# EAGLE design ESP8266_BREAKOUT (EAGLE 7.2.0)
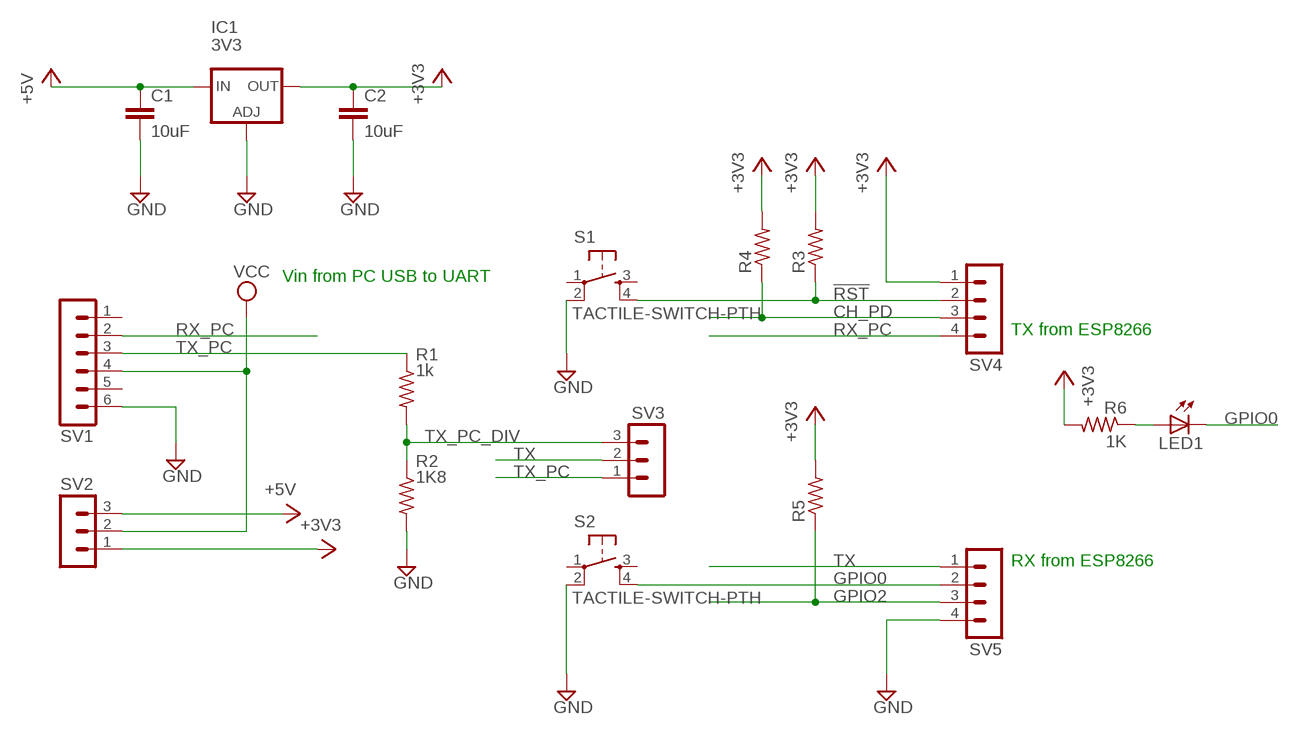
[diagram p0: schematic, sheet 1]

## Parts
C1  10uF  C5/2.5  [C5B2.5]
C2  10uF  C5/2.5  [C5B2.5]
IC1  3V3  LM317TS  [317TS]
LED1  LED5MM  [LED5MM]
R1  1k  R-US_0204/7  [0204/7]
R2  1K8  R-US_0204/7  [0204/7]
R3  R-US_0204/7  [0204/7]
R4  R-US_0204/7  [0204/7]
R5  R-US_0204/7  [0204/7]
R6  1K  R-US_0204/7  [0204/7]
S1  TACTILE-SWITCH-PTH  [TAC-SWITCH-PTH]
S2  TACTILE-SWITCH-PTH  [TAC-SWITCH-PTH]
SV1  MA06-1  [MA06-1]
SV2  MA03-1  [MA03-1]
SV3  MA03-1  [MA03-1]
SV4  MA04-1  [MA04-1]
SV5  MA04-1  [MA04-1]

## Nets
!RST: R3.1 S1.4 SV4.2
+3V3: C2.1 IC1.2(OUT) R3.2 R4.2 R5.2 R6.2 SV2.1 SV4.1
+5V: C1.1 IC1.3(IN) SV2.3
CH_PD: R4.1 SV4.3
GND: C1.2 C2.2 IC1.1(ADJ) R2.2 S1.2 S2.2 SV1.6 SV5.4
GPIO0: LED1.K(C) S2.4 SV5.2
GPIO2: R5.1 SV5.3
N$1: LED1.A R6.1
RX_PC: SV1.2 SV4.4
TX: SV3.2 SV5.1
TX_PC: R1.1 SV1.3 SV3.1
TX_PC_DIV: R1.2 R2.1 SV3.3
VCC: SV1.4 SV2.2
Unconnected: S1.1 S1.3 S2.1 S2.3 SV1.1 SV1.5

## Notes on the sheet
- Vin from PC USB to UART
- TX from ESP8266
- RX from ESP8266

## Library data of the parts
C1 C2 = capacitor-wima:C: CAPACITOR naming: grid - package width
IC1 = v-reg:LM317TS: VOLTAGE REGULATOR
LED1 = led:LED: LED OSRAM: - CHIPLED LG R971, LG N971, LY N971, LG Q971, LY Q971, LO R971, LY R971 LH N974, LH R974 LS Q976, LO Q976, LY Q976 LO Q996 - Hyper CHIPLED LW Q18S LB Q993, LB Q99A, LB R99A - SideLED LS A670, LO A670, LY A670, LG A670, LP A670 LB A673, LV A673, LT A673, LW A673 LH A674 LY A675 LS A676, LA A676, LO A676, LY A676, LW A676 LS A679, LY A679, LG A679 - Hyper Micro SIDELED® LS Y876, LA Y876, LO Y876, LY Y876 LT Y87S - SmartLED LW L88C, LW L88S LB L89C, LB L89S, LG L890 LS L89K, LO L89K, LY L89K LS L896, LA L896, LO L896, LY L896 - TOPLED LS T670, LO T670, LY T670, LG T670, LP T670 LSG T670, LSP T670, LSY T670, LOP T670, LYG T670 LG T671, LOG T671, LSG T671 LB T673, LV T673, LT T673, LW T673 LH T674 LS T676, LA T676, LO T676, LY T676, LB T676, LH T676, LSB T676, LW T676 LB T67C, LV T67C, LT T67C, LS T67K, LO T67K, LY T67K, LW E67C LS E67B, LA E67B, LO E67B, LY E67B, LB E67C, LV E67C, LT E67C LW T67C LS T679, LY T679, LG T679 LS T770, LO T770, LY T770, LG T770, LP T770 LB T773, LV T773, LT T773, LW T773 LH T774 LS E675, LA E675, LY E675, LS T675 LS T776, LA T776, LO T776, LY T776, LB T776 LHGB T686 LT T68C, LB T68C - Hyper Mini TOPLED® LB M676 - Mini TOPLED Santana® LG M470 LS M47K, LO M47K, LY M47K Source: http://www.osram.convergy.de LUXEON: - LUMILED® LXK2-PW12-R00, LXK2-PW12-S00, LXK2-PW14-U00, LXK2-PW14-V00 LXK2-PM12-R00, LXK2-PM12-S00, LXK2-PM14-U00 LXK2-PE12-Q00, LXK2-PE12-R00, LXK2-PE12-S00, LXK2-PE14-T00, LXK2-PE14-U00 LXK2-PB12-K00, LXK2-PB12-L00, LXK2-PB12-M00, LXK2-PB14-N00, LXK2-PB14-P00, LXK2-PB14-Q00 LXK2-PR12-L00, LXK2-PR12-M00, LXK2-PR14-Q00, LXK2-PR14-R00 LXK2-PD12-Q00, LXK2-PD12-R00, LXK2-PD12-S00 LXK2-PH12-R00, LXK2-PH12-S00 LXK2-PL12-P00, LXK2-PL12-Q00, LXK2-PL12-R00 Source: www.luxeon.com KINGBRIGHT: KA-3528ASYC Source: www.kingbright.com
R1-R6 = resistor:R-US_: RESISTOR, American symbol
S1 S2 = GeekAmmo:TACTILE-SWITCH: Tactile Switch 4 Pins, SPST NO
SV1 = con-lstb:MA06-1: PIN HEADER; OC_FARNELL: unknown; OC_NEWARK: unknown
SV2 SV3 = con-lstb:MA03-1: PIN HEADER; OC_FARNELL: unknown; OC_NEWARK: unknown
SV4 SV5 = con-lstb:MA04-1: PIN HEADER; OC_FARNELL: unknown; OC_NEWARK: unknown

## Board
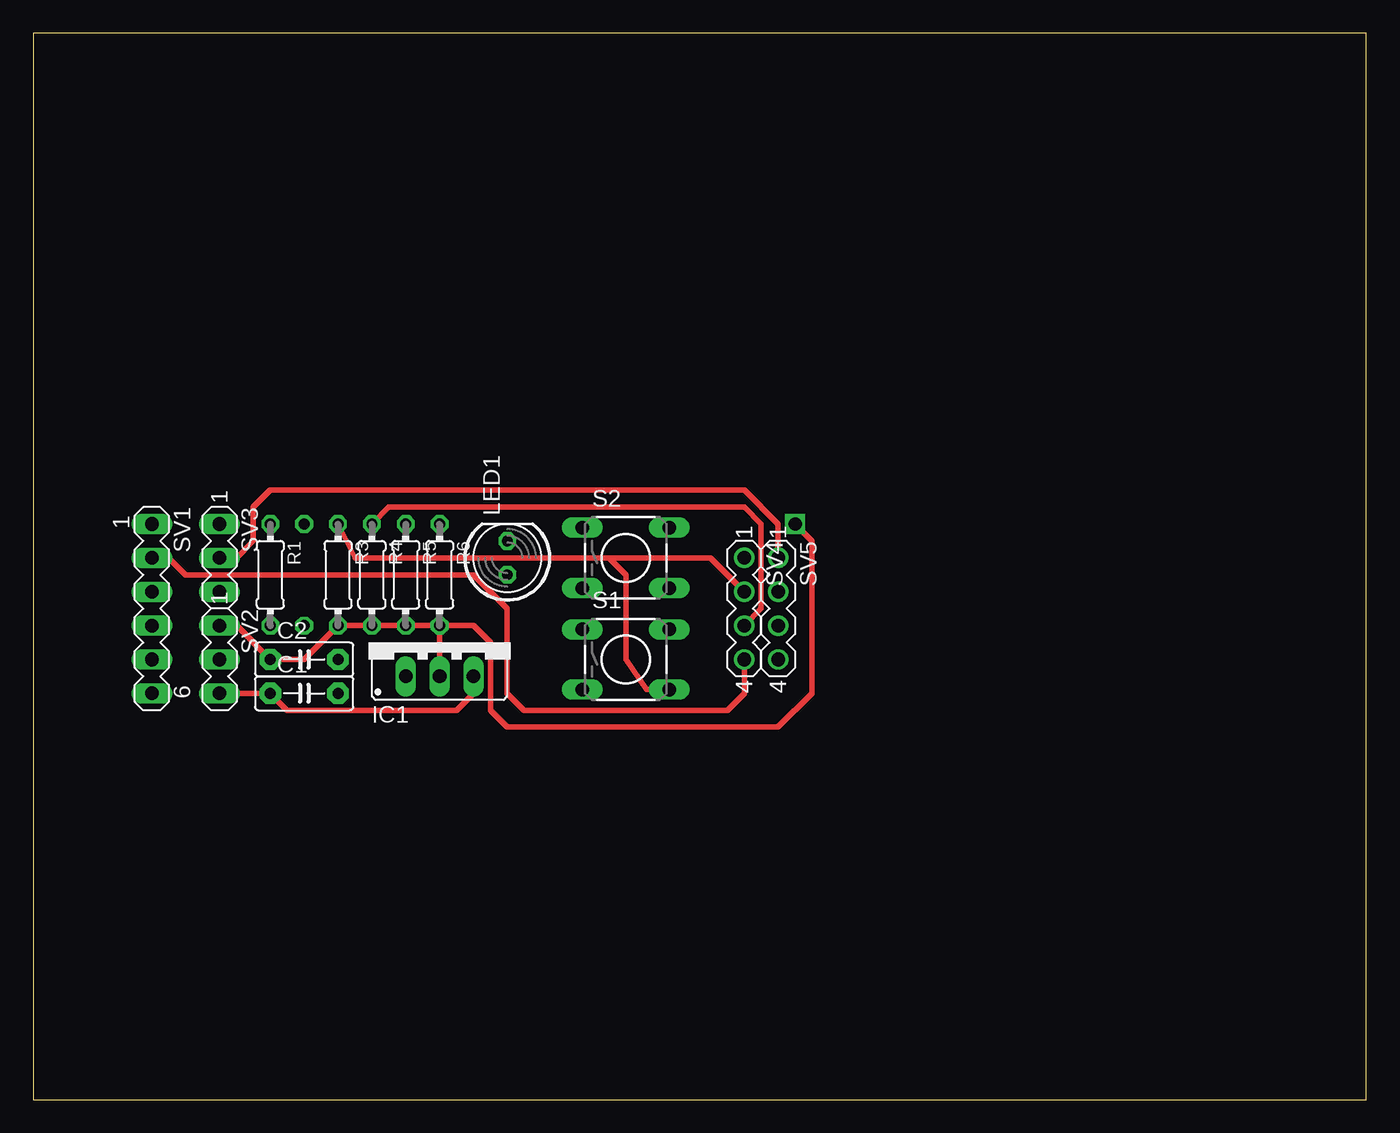
[diagram p1: board, top side]
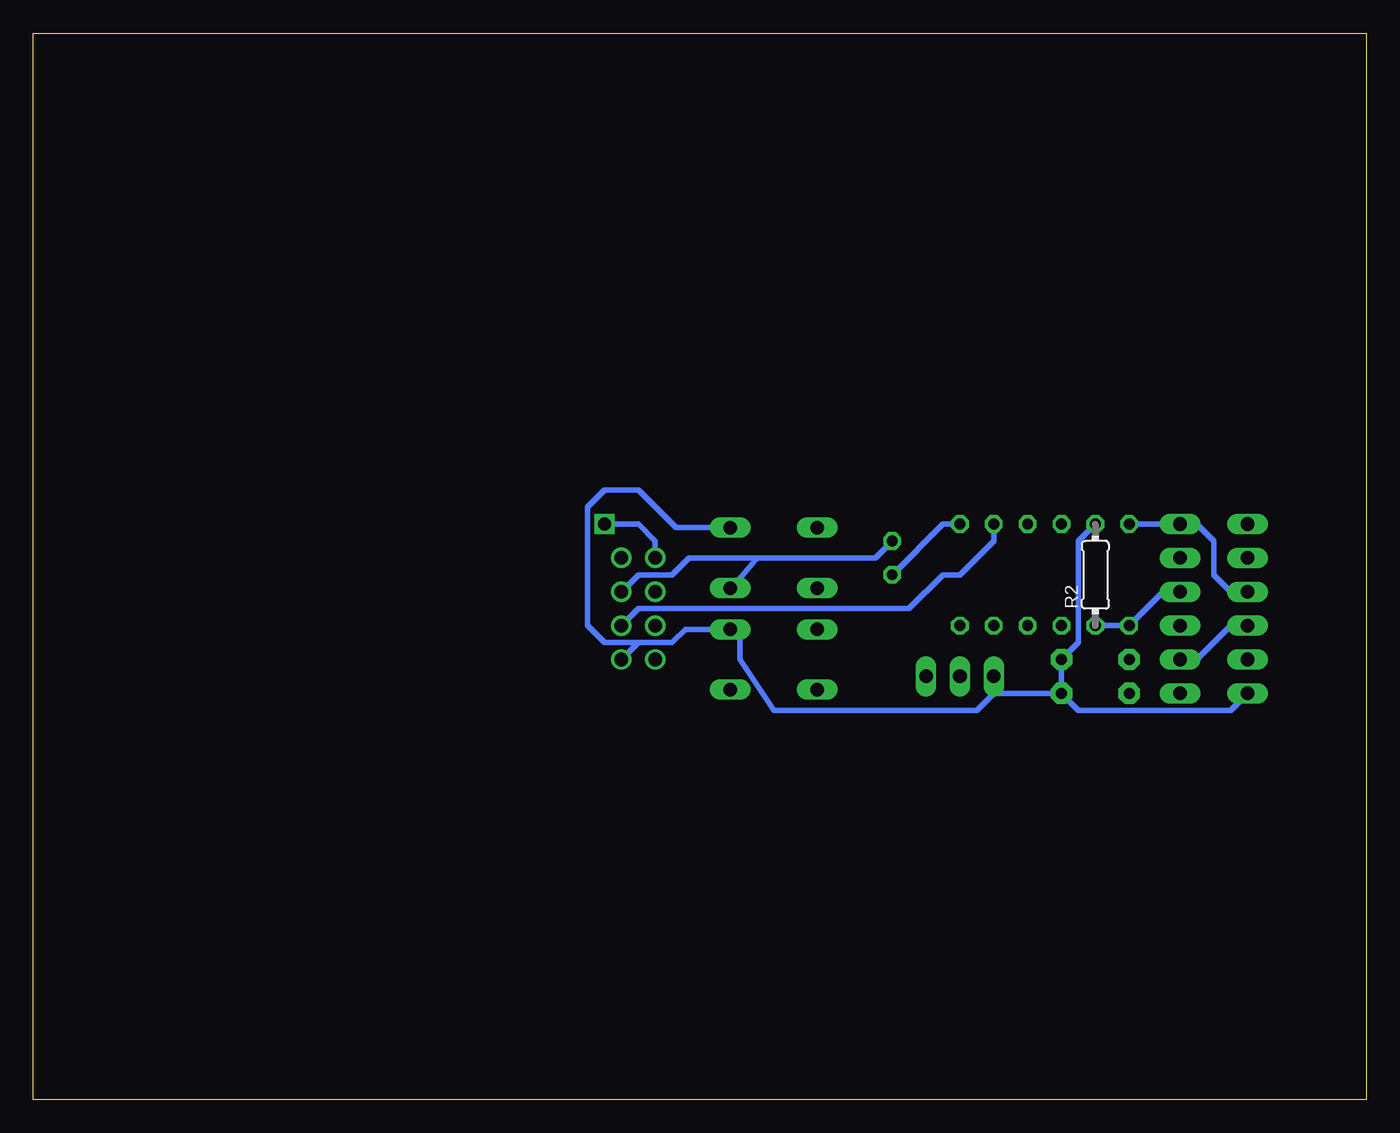
[diagram p2: board, bottom side, seen from below]

Size 100 x 80 mm. Coordinates in mm from the lower left corner, seen from the top.
Outline: 0,0 100,0 100,80 0,80 0,0
Copper layers (1*16): Top 0.035mm / dielectric 1.5mm / Bottom 0.035mm
Design rules "default": minimum track width 10mil, minimum drill 24mil, track to track 8mil, track to pad 8mil, pad to pad 8mil, via to via 8mil, smd to smd 8mil, copper to edge 40mil, drill to drill 8mil, minimum pad ring 10mil, minimum via ring 8mil, stop-mask expansion 4mil, vias tented up to drill 0mil, thermal gap 10mil

### Footprints (pad centres in the part's own frame; a part is rotated, then mirrored left to right if it is on the bottom)
C5B2.5 = drill 0.813 pad 1.6 octagon: 1 -2.54,0; 2 2.54,0
317TS = drill 1.016 long: 1 -2.54,-2.54; 2 0,-2.54; 3 2.54,-2.54
LED5MM = drill 0.813 octagon: A -1.27,0; K 1.27,0
0204/7 = drill 0.813 octagon: 1 -3.81,0; 2 3.81,0
TAC-SWITCH-PTH = drill 1.016 pad 1.524 long: 1 -3.251,2.261; 2 3.251,2.261; 3 -3.251,-2.261; 4 3.251,-2.261
MA06-1 = drill 1.016 long: 1 -6.35,0; 2 -3.81,0; 3 -1.27,0; 4 1.27,0; 5 3.81,0; 6 6.35,0
MA03-1 = drill 1.016 long: 1 -2.54,0; 2 0,0; 3 2.54,0
MA04-1 = drill 1.016: 1 -3.81,0; 2 -1.27,0; 3 1.27,0; 4 3.81,0

### Placement (x,y rotation side)
C1  20.32,30.48 0 top
C2  20.32,33.02 0 top
IC1  30.48,34.29 0 top
LED1  35.56,40.64 90 top
R1  17.78,39.37 270 top
R2  20.32,39.37 90 bottom
R3  22.86,39.37 270 top
R4  25.4,39.37 270 top
R5  27.94,39.37 270 top
R6  30.48,39.37 270 top
S1  44.45,33.02 0 top
S2  44.45,40.64 0 top
SV1  8.89,36.83 270 top
SV2  13.97,33.02 270 top
SV3  13.97,40.64 270 top
SV4  53.34,36.83 270 top
SV5  55.88,36.83 270 top

### Tracks (layer width: path | path; a pad name or v marks a point on that pad's centre or on a via)
!RST
  Top 0.406: R3.1 24.13,40.64 43.18,40.64 | 43.18,40.64 50.8,40.64 SV4.2 | S1.4 46,30.76 44.45,33.02 44.45,39.37 43.18,40.64
+3V3  (via drill 1)
  Top 0.406: SV2.1 15.24,35.56 C2.1 20.32,33.02 R3.2 R4.2 R5.2 R6.2 | R6.2 33.02,35.56 34.29,34.29 34.29,29.21 35.56,27.94 55.88,27.94 58.42,30.48 58.42,41.91 v57.15,43.18 | R6.2 IC1.2
  Bottom 0.406: v57.15,43.18 54.61,43.18 53.34,41.91 SV4.1
+5V
  Top 0.406: SV2.3 C1.1 19.05,29.21 31.75,29.21 33.02,30.48 IC1.3
CH_PD
  Top 0.406: R4.1 26.67,44.45 53.34,44.45 54.61,43.18 54.61,36.83 SV4.3
GND
  Bottom 0.406: SV1.6 10.16,29.21 21.59,29.21 C1.2 | 27.94,30.48 C1.2 | C1.2 C2.2 21.59,34.29 21.59,41.91 R2.2 | IC1.1 27.94,30.48 | 27.94,30.48 29.21,29.21 44.45,29.21 46.99,33.02 46.99,34.57 S1.2 51.08,35.28 52.07,34.29 54.61,34.29 | 54.61,34.29 SV5.4 | S2.2 51.79,42.9 54.61,45.72 57.15,45.72 58.42,44.45 58.42,35.56 57.15,34.29 54.61,34.29
GPIO0
  Bottom 0.406: 45.72,40.64 36.83,40.64 LED1.K | 45.72,40.64 46.99,39.09 S2.4 | SV5.2 54.61,39.37 52.07,39.37 50.8,40.64 45.72,40.64
GPIO2
  Bottom 0.406: R5.1 27.94,41.91 30.48,39.37 31.75,39.37 34.29,36.83 54.61,36.83 SV5.3
N$1
  Bottom 0.406: R6.1 31.75,43.18 LED1.A
RX_PC
  Top 0.406: SV1.2 10.16,40.64 11.43,39.37 33.02,39.37 35.56,36.83 35.56,30.48 36.83,29.21 52.07,29.21 53.34,30.48 SV4.4
TX
  Top 0.406: SV3.2 15.24,40.64 16.51,41.91 16.51,44.45 17.78,45.72 53.34,45.72 55.88,43.18 SV5.1
TX_PC
  Bottom 0.406: SV1.3 10.16,38.1 11.43,39.37 11.43,41.91 12.7,43.18 SV3.1 R1.1
TX_PC_DIV
  Bottom 0.406: SV3.3 15.24,38.1 R1.2 R2.1
VCC
  Bottom 0.406: SV1.4 10.16,35.56 12.7,33.02 SV2.2